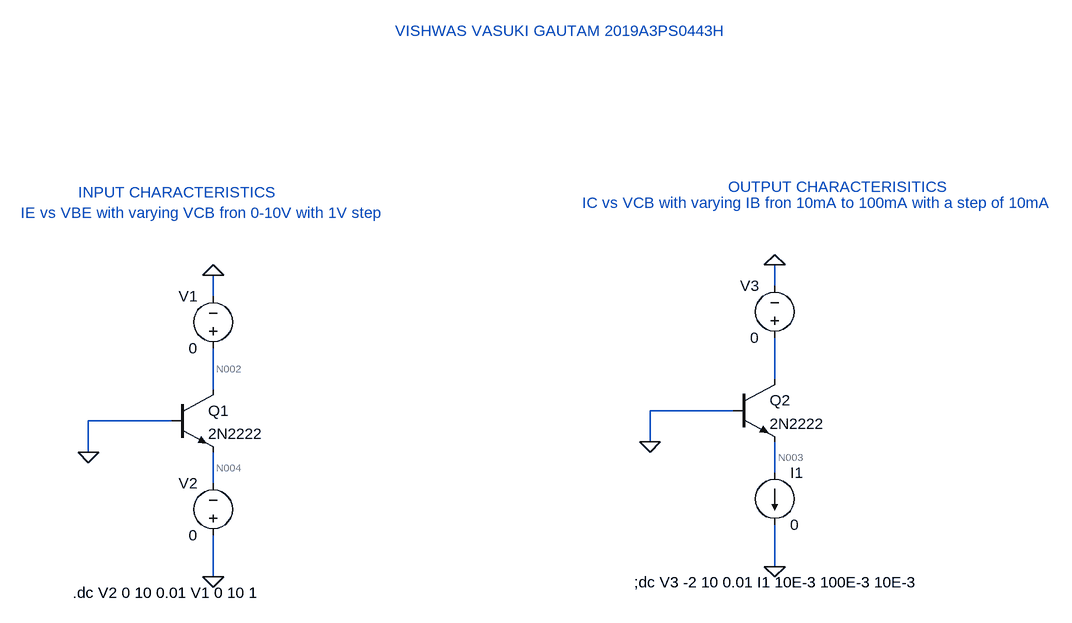
[diagram p0: schematic BJT_CB_characteristics.asc]
BJT_CB_characteristics.asc, the LTspice schematic file:
Version 4
SHEET 1 1624 680
WIRE 1056 -80 1056 -112
WIRE 192 -64 192 -96
WIRE 1056 64 1056 0
WIRE 192 80 192 16
WIRE 992 112 864 112
WIRE 128 128 0 128
WIRE 864 160 864 112
WIRE 0 176 0 128
WIRE 1056 208 1056 160
WIRE 192 224 192 176
WIRE 1056 352 1056 288
WIRE 192 368 192 304
FLAG 0 176 0
FLAG 192 368 0
FLAG 192 -96 0
FLAG 864 160 0
FLAG 1056 352 0
FLAG 1056 -112 0
SYMBOL npn 128 80 R0
SYMATTR InstName Q1
SYMATTR Value 2N2222
SYMBOL voltage 192 32 R180
WINDOW 0 24 96 Left 2
WINDOW 3 24 16 Left 2
WINDOW 123 0 0 Left 2
WINDOW 39 0 0 Left 2
SYMATTR InstName V1
SYMATTR Value 0
SYMBOL voltage 192 320 R180
WINDOW 0 24 96 Left 2
WINDOW 3 24 16 Left 2
WINDOW 123 0 0 Left 2
WINDOW 39 0 0 Left 2
SYMATTR InstName V2
SYMATTR Value 0
SYMBOL npn 992 64 R0
SYMATTR InstName Q2
SYMATTR Value 2N2222
SYMBOL voltage 1056 16 R180
WINDOW 0 24 96 Left 2
WINDOW 3 24 16 Left 2
WINDOW 123 0 0 Left 2
WINDOW 39 0 0 Left 2
SYMATTR InstName V3
SYMATTR Value 0
SYMBOL current 1056 208 R0
WINDOW 123 0 0 Left 2
WINDOW 39 0 0 Left 2
SYMATTR InstName I1
SYMATTR Value 0
TEXT -24 392 Left 2 !.dc V2 0 10 0.01 V1 0 10 1
TEXT -16 -224 Left 2 ;INPUT CHARACTERISTICS
TEXT -104 -192 Left 2 ;IE vs VBE with varying VCB fron 0-10V with 1V step
TEXT 840 376 Left 2 !;dc V3 -2 10 0.01 I1 10E-3 100E-3 10E-3
TEXT 760 -208 Left 2 ;IC vs VCB with varying IB fron 10mA to 100mA with a step of 10mA
TEXT 984 -232 Left 2 ;OUTPUT CHARACTERISITICS
TEXT 472 -472 Left 2 ;VISHWAS VASUKI GAUTAM 2019A3PS0443H

The netlist it stands for:
* BJT_CB_characteristics.asc
Q1 N002 0 N004 0 2N2222
V1 N002 0 0
V2 0 N004 0
Q2 N001 0 N003 0 2N2222
V3 N001 0 0
I1 N003 0 0
.model NPN NPN
.model PNP PNP
.lib standard.bjt
.dc V2 0 10 0.01 V1 0 10 1
* INPUT CHARACTERISTICS
* IE vs VBE with varying VCB fron 0-10V with 1V step
;dc V3 -2 10 0.01 I1 10E-3 100E-3 10E-3
* IC vs VCB with varying IB fron 10mA to 100mA with a step of 10mA
* OUTPUT CHARACTERISITICS
* VISHWAS VASUKI GAUTAM 2019A3PS0443H
.backanno
.end

* Results of the author's LTspice run, read from the files saved beside the schematic
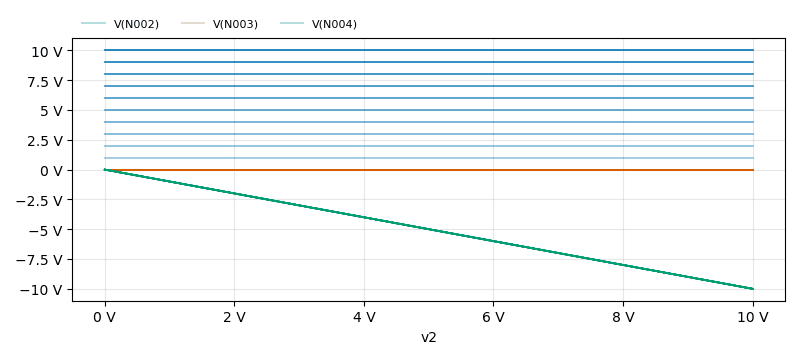
[diagram p1: DC transfer characteristic of BJT_CB_characteristics.asc, plotted from the saved traces]
* DC transfer characteristic, 11 runs:
*   V(N002) [v1=0]: 0 V at v2=0 V, 0 V at v2=10 V, min 0 V, max 0 V
*   V(N002) [v1=1]: 1 V at v2=0 V, 1 V at v2=10 V, min 1 V, max 1 V
*   V(N002) [v1=2]: 2 V at v2=0 V, 2 V at v2=10 V, min 2 V, max 2 V
*   V(N002) [v1=3]: 3 V at v2=0 V, 3 V at v2=10 V, min 3 V, max 3 V
*   V(N002) [v1=4]: 4 V at v2=0 V, 4 V at v2=10 V, min 4 V, max 4 V
*   V(N002) [v1=5]: 5 V at v2=0 V, 5 V at v2=10 V, min 5 V, max 5 V
*   V(N002) [v1=6]: 6 V at v2=0 V, 6 V at v2=10 V, min 6 V, max 6 V
*   V(N002) [v1=7]: 7 V at v2=0 V, 7 V at v2=10 V, min 7 V, max 7 V
*   V(N003) [v1=0]: 0 V at v2=0 V, 0 V at v2=10 V, min 0 V, max 0 V
*   V(N003) [v1=1]: -0.01627 fV at v2=0 V, 0 V at v2=10 V, min -0.01627 fV, max 1.665e-07 fV
*   V(N003) [v1=2]: -0.01627 fV at v2=0 V, 0 V at v2=10 V, min -0.01627 fV, max 1.665e-07 fV
*   V(N003) [v1=3]: -0.01627 fV at v2=0 V, 0 V at v2=10 V, min -0.01627 fV, max 1.665e-07 fV
*   V(N003) [v1=4]: -0.01627 fV at v2=0 V, 0 V at v2=10 V, min -0.01627 fV, max 1.665e-07 fV
*   V(N003) [v1=5]: -0.01627 fV at v2=0 V, 0 V at v2=10 V, min -0.01627 fV, max 1.665e-07 fV
*   V(N003) [v1=6]: -0.01627 fV at v2=0 V, 0 V at v2=10 V, min -0.01627 fV, max 1.665e-07 fV
*   V(N003) [v1=7]: -0.01627 fV at v2=0 V, 0 V at v2=10 V, min -0.01627 fV, max 1.665e-07 fV
*   V(N004) [v1=0]: 0 V at v2=0 V, -10 V at v2=10 V, min -10 V, max 0 V
*   V(N004) [v1=1]: 0 V at v2=0 V, -10 V at v2=10 V, min -10 V, max 0 V
*   V(N004) [v1=2]: 0 V at v2=0 V, -10 V at v2=10 V, min -10 V, max 0 V
*   V(N004) [v1=3]: 0 V at v2=0 V, -10 V at v2=10 V, min -10 V, max 0 V
*   V(N004) [v1=4]: 0 V at v2=0 V, -10 V at v2=10 V, min -10 V, max 0 V
*   V(N004) [v1=5]: 0 V at v2=0 V, -10 V at v2=10 V, min -10 V, max 0 V
*   V(N004) [v1=6]: 0 V at v2=0 V, -10 V at v2=10 V, min -10 V, max 0 V
*   V(N004) [v1=7]: 0 V at v2=0 V, -10 V at v2=10 V, min -10 V, max 0 V